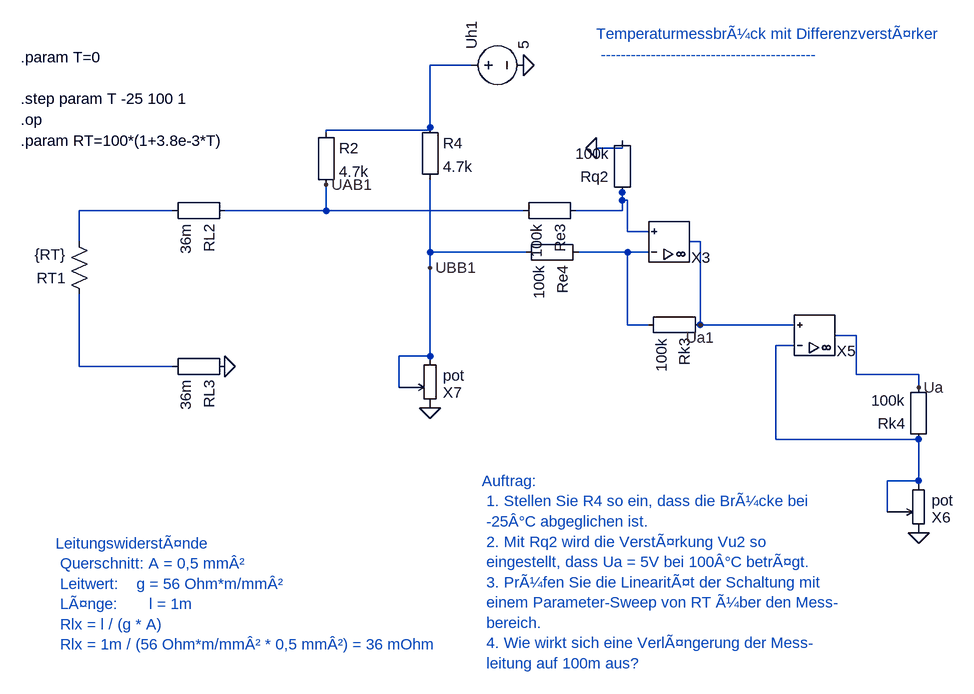
[diagram p0: schematic 1_3_2_PT100-Sensor_mit_Brueckenschaltung_var.asc]
1_3_2_PT100-Sensor_mit_Brueckenschaltung_var.asc, the LTspice schematic file:
Version 4
SHEET 1 880 680
WIRE 896 240 936 240
WIRE 936 240 936 228
WIRE 976 368 944 368
WIRE 944 368 944 320
WIRE 944 320 936 320
WIRE 936 320 936 308
WIRE 936 308 936 336
WIRE 936 336 864 336
WIRE 976 400 944 400
WIRE 944 400 868 400
WIRE 944 400 944 464
WIRE 944 464 944 512
WIRE 944 512 976 512
WIRE 1040 384 1056 384
WIRE 1056 384 1056 512
WIRE 1056 512 1200 512
WIRE 100 464 100 576
WIRE 100 576 244 576
WIRE 100 384 100 336
WIRE 100 336 244 336
WIRE 324 336 424 336
WIRE 424 336 480 336
WIRE 480 336 480 296
WIRE 480 336 784 336
WIRE 704 112 640 112
WIRE 640 112 640 208
WIRE 640 208 640 212
WIRE 640 212 480 212
WIRE 480 212 480 216
WIRE 640 288 640 400
WIRE 640 400 788 400
WIRE 640 400 640 424
WIRE 640 424 640 560
WIRE 640 560 592 560
WIRE 592 560 592 608
WIRE 1200 544 1172 544
WIRE 1172 544 1172 640
WIRE 1172 640 1172 688
WIRE 1172 688 1200 688
WIRE 1200 688 1392 688
WIRE 1392 688 1392 752
WIRE 1392 752 1344 752
WIRE 1344 752 1344 800
WIRE 1264 528 1296 528
WIRE 1296 528 1296 588
WIRE 1296 588 1392 588
WIRE 1392 588 1392 608
FLAG 1056 512 Ua1
FLAG 1392 608 Ua
FLAG 480 296 UAB1
FLAG 640 424 UBB1
FLAG 784 112 0
FLAG 896 240 0
FLAG 1392 832 0
FLAG 324 576 0
FLAG 640 640 0
SYMBOL opamp 1008 384 M180
SYMATTR InstName X3
SYMATTR Prefix X
SYMATTR SpiceModel opamp
SYMBOL res 116 480 R180
SYMATTR InstName RT1
SYMATTR Value {RT}
SYMBOL Misc\EuropeanResistor 340 320 R90
SYMATTR InstName RL2
SYMATTR Value 36m
SYMBOL Misc\EuropeanResistor 340 560 R90
SYMATTR InstName RL3
SYMATTR Value 36m
SYMBOL Misc\EuropeanResistor 880 320 R90
SYMATTR InstName Re3
SYMATTR Value 100k
SYMBOL voltage 688 112 R270
SYMATTR InstName Uh1
SYMATTR Value 5
SYMBOL Misc\EuropeanResistor 464 200 R0
SYMATTR InstName R2
SYMATTR Value 4.7k
SYMBOL Misc\EuropeanResistor 624 192 R0
SYMATTR InstName R4
SYMATTR Value 4.7k
SYMBOL Misc\EuropeanResistor 952 324 R180
SYMATTR InstName Rq2
SYMATTR Value 100k
SYMBOL Misc\EuropeanResistor 1072 496 R90
SYMATTR InstName Rk3
SYMATTR Value 100k
SYMBOL Misc\EuropeanResistor 884 384 R90
SYMATTR InstName Re4
SYMATTR Value 100k
SYMBOL opamp 1232 528 M180
SYMATTR InstName X5
SYMATTR Prefix X
SYMATTR SpiceModel opamp
SYMBOL Misc\EuropeanResistor 1408 704 R180
SYMATTR InstName Rk4
SYMATTR Value 100k
SYMBOL pot 1408 848 R180
SYMATTR InstName X6
SYMATTR Value pot
SYMATTR SpiceLine Rtot=2k wiper=1
SYMATTR LibreSpice pins=A,W,B
SYMBOL pot 656 656 R180
SYMATTR InstName X7
SYMATTR Value pot
SYMATTR SpiceLine Rtot=100 wiper=.90572
SYMATTR LibreSpice pins=A,W,B
TEXT 10 100 Left 2 !.param T=0
TEXT 10 228 Left 2 !.param RT=100*(1+3.8e-3*T)
TEXT 10 164 Left 2 !.step param T -25 100 1
TEXT 10 196 Left 2 !.op
TEXT 64 848 Left 2 ;LeitungswiderstÃ¤nde \n Querschnitt: A = 0,5 mmÂ² \n Leitwert:    g = 56 Ohm*m/mmÂ² \n LÃ¤nge:       l = 1m \n Rlx = l / (g * A) \n Rlx = 1m / (56 Ohm*m/mmÂ² * 0,5 mmÂ²) = 36 mOhm
TEXT 720 752 Left 2 ;Auftrag: \n 1. Stellen Sie R4 so ein, dass die BrÃ¼cke bei \n -25Â°C abgeglichen ist. \n 2. Mit Rq2 wird die VerstÃ¤rkung Vu2 so \n eingestellt, dass Ua = 5V bei 100Â°C betrÃ¤gt. \n 3. PrÃ¼fen Sie die LinearitÃ¤t der Schaltung mit \n einem Parameter-Sweep von RT Ã¼ber den Mess- \n bereich. \n 4. Wie wirkt sich eine VerlÃ¤ngerung der Mess- \n leitung auf 100m aus?
TEXT 896 64 Left 2 ;TemperaturmessbrÃ¼ck mit DifferenzverstÃ¤rker \n -------------------------------------------

The netlist it stands for:
* 1_3_2_PT100-Sensor_mit_Brueckenschaltung_var.asc
XX3 N001 N002 Ua1 opamp opamp  ; pins In+ In- OUT
RT1 N003 N004 {RT}
RL2 UAB1 N004 36m
RL3 0 N003 36m
Re3 N001 UAB1 100k
V§Uh1 N005 0 5
R2 N005 UAB1 4.7k
R4 N005 UBB1 4.7k
Rq2 N001 0 100k
Rk3 Ua1 N002 100k
Re4 N002 UBB1 100k
XX5 Ua1 N006 Ua opamp opamp  ; pins In+ In- OUT
Rk4 N006 Ua 100k
XX6 0 N006 N006 pot pot Rtot=2k wiper=1  ; pins A W B
XX7 0 UBB1 UBB1 pot pot Rtot=100 wiper=.90572  ; pins A W B
.param T=0
.param RT=100*(1+3.8e-3*T)
.step param T -25 100 1
.op
* LeitungswiderstÃ¤nde
*  Querschnitt: A = 0,5 mmÂ²
*  Leitwert:    g = 56 Ohm*m/mmÂ²
*  LÃ¤nge:       l = 1m
*  Rlx = l / (g * A)
*  Rlx = 1m / (56 Ohm*m/mmÂ² * 0,5 mmÂ²) = 36 mOhm
* Auftrag:
*  1. Stellen Sie R4 so ein, dass die BrÃ¼cke bei
*  -25Â°C abgeglichen ist.
*  2. Mit Rq2 wird die VerstÃ¤rkung Vu2 so
*  eingestellt, dass Ua = 5V bei 100Â°C betrÃ¤gt.
*  3. PrÃ¼fen Sie die LinearitÃ¤t der Schaltung mit
*  einem Parameter-Sweep von RT Ã¼ber den Mess-
*  bereich.
*  4. Wie wirkt sich eine VerlÃ¤ngerung der Mess-
*  leitung auf 100m aus?
* TemperaturmessbrÃ¼ck mit DifferenzverstÃ¤rker
*  -------------------------------------------
.lib opamp.lib
.lib pot.lib
.backanno
.end